# Altium schematic sheet ESP32.SchDoc
size A; SheetNumber: 4; SheetTotal: 6
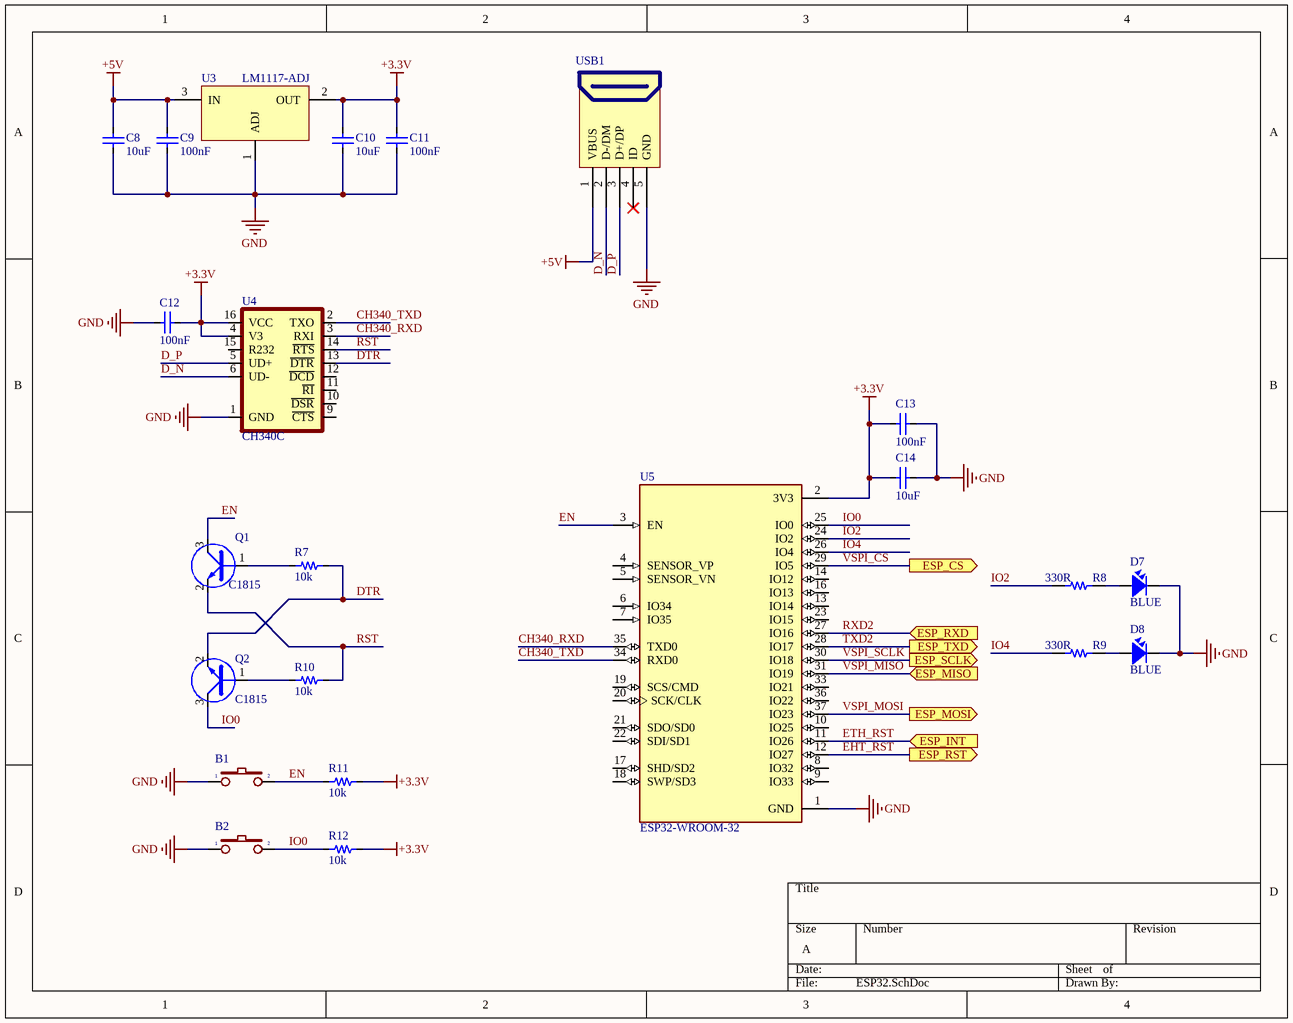
[diagram p0: ESP32.SchDoc]

## Parts
B1  Button 3x4x2.5  [Button 3x4x2.5]  (value not drawn)
B2  Button 3x4x2.5  [BUTTON NGHIENG]  (value not drawn)
C8  10uF  [CAP_0603]
C9  100nF  [CAP_0603]
C10  10uF  [CAP_0603]
C11  100nF  [CAP_0603]
C12  100nF  [CAP_0603]
C13  100nF  [CAP_0603]
C14  10uF  [CAP_0603]
D7  BLUE  [LED-0603-Green]
D8  BLUE  [LED-0603-Green]
Q1  C1815  [SOT23D]
Q2  C1815  [SOT23D]
R7  10k  [RES-SMD-0603]
R8  330R  [RES-SMD-0603]
R9  330R  [RES-SMD-0603]
R10  10k  [RES-SMD-0603]
R11  10k  [RES-SMD-0603]
R12  10k  [RES-SMD-0603]
U3  LM1117-ADJ  [LM1117-SOP]
U4  CH340C  [SO16]
U5  ESP32-WROOM-32  [ESP32_UE]
USB1  USB Micro 5p DIP  [USB Micro 5p DIP]  (value not drawn)

## Ports
ESP_CS (out), ESP_INT (in), ESP_MISO (in), ESP_MOSI (out), ESP_RST (out), ESP_RXD (in), ESP_SCLK (out), ESP_TXD (out)

## Nets
+3.3V: C10.1 C11.1 C12.1 C13.1 C14.1 R11.1 R12.1 U3.2(OUT) U4.4(V3) U4.16(VCC) U5.2(3V3)
+5V: C8.1 C9.1 U3.3(IN) USB1.1(VBUS)
GND: B1.1 B2.1 C8.2 C9.2 C10.2 C11.2 C12.2 C13.2 C14.2 D7.2 D8.2 U3.1(ADJ) U4.1(GND) U5.1(GND) USB1.5(GND)
CH340_RXD: U4.3(RXI) U5.35(TXD0)
CH340_TXD: U4.2(TXO) U5.34(RXD0)
D_N: U4.6(UD-) USB1.2(D-/DM)
D_P: U4.5(UD+) USB1.3(D+/DP)
DTR: Q2.2(E) R7.1 U4.13(~{DTR})
EHT_RST: U5.12(IO27) ; port ESP_RST
EN: B1.2 Q1.3(C) R11.2 U5.3(EN)
ETH_RST: U5.11(IO26) ; port ESP_INT
IO0: B2.2 Q2.3(C) R12.2 U5.25(IO0)
IO2: R8.2 U5.24(IO2)
IO4: R9.2 U5.26(IO4)
RST: Q1.2(E) R10.1 U4.14(~{RTS})
RXD2: U5.27(IO16) ; port ESP_RXD
TXD2: U5.28(IO17) ; port ESP_TXD
VSPI_CS: U5.29(IO5) ; port ESP_CS
VSPI_MISO: U5.31(IO19) ; port ESP_MISO
VSPI_MOSI: U5.37(IO23) ; port ESP_MOSI
VSPI_SCLK: U5.30(IO18) ; port ESP_SCLK
NetD7_1: D7.1 R8.1
NetD8_1: D8.1 R9.1
NetQ1_1: Q1.1(B) R7.2
NetQ2_1: Q2.1(B) R10.2

Not connected (* = marked no-connect by the designer): U4 9(~{CTS}) 10(~{DSR}) 11(~{RI}) 12(~{DCD}) 15(R232); U5 4(SENSOR_VP) 5(SENSOR_VN) 6(IO34) 7(IO35) 8(IO32) 9(IO33) 10(IO25) 13(IO14) 14(IO12) 16(IO13) 17(SHD/SD2) 18(SWP/SD3) 19(SCS/CMD) 20(SCK/CLK) 21(SDO/SD0) 22(SDI/SD1) 23(IO15) 33(IO21) 36(IO22); USB1 4(ID)*

## Library data of the parts
C8-C14 = CapSMD: Capacitor; Value: 33p; Published: 8-Jun-2000; LatestRevisionDate: 17-Jul-2002; LatestRevisionNote: Re-released for DXP Platform.; PackageReference: RAD-0.3; Publisher: Altium Limited
D7 D8 = LED: LED Single colour Green and Red; Value: LED 3 ly Single Colour
Q1 Q2 = 2SC1815: NPN 600mW, ECB; Value: C1815
R7-R12 = Resistor - SMD: Resistor; Manufacturer: Generic Components; Class: Passive; Published: 08/06/2000; Publisher: Altium Hobart Technology Centre
U3 = LM1117-ADJ: 800mA Low-Dropout Linear Regulator; Creator: Nguyen Ba Bien; Website: http://group3i.net
U4 = CH340C: USB to serial chip CH340; MF: WCH; Package: Package; Check_prices: https://www.snapeda.com/parts/CH340C/WCH/view-part/5428851/?ref=eda; Value: *; Price: None; MP: CH340C; Availability: Unavailable; SnapEDA_Link: https://www.snapeda.com/parts/CH340C/WCH/view-part/5428851/?ref=snap
U5 = ESP32-WROOM-32: Bluetooth, WiFi Transceiver Module 2.4GHz ~ 2.5GHz Surface Mount; MF: Espressif Systems; Package: Module Espressif Systems; Digi-Key_Part_Number: 1904-1010-1-ND; Digi-Key_Purchase_URL: https://www.digikey.com/product-detail/en/espressif-systems/ESP32-WROOM-32/1904-1010-1-ND/8544305?utm_source=snapeda&utm_medium=aggregator&utm_campaign=symbol; Value: *; MP: ESP32-WROOM-32; SnapEDA_Link: https://www.snapeda.com/parts/ESP32-WROOM-32/Espressif%20Systems/view-part/2753322/?ref=snap
USB1 = USB Micro 5p DIP: USB Type B; Ten: MicroUSB MK5P DIP; Ma_Hang: MH005145